# Altium schematic sheet Connector-Sheet.SchDoc
size 420 x 297 mm; SheetNumber: 3; SheetTotal: 3
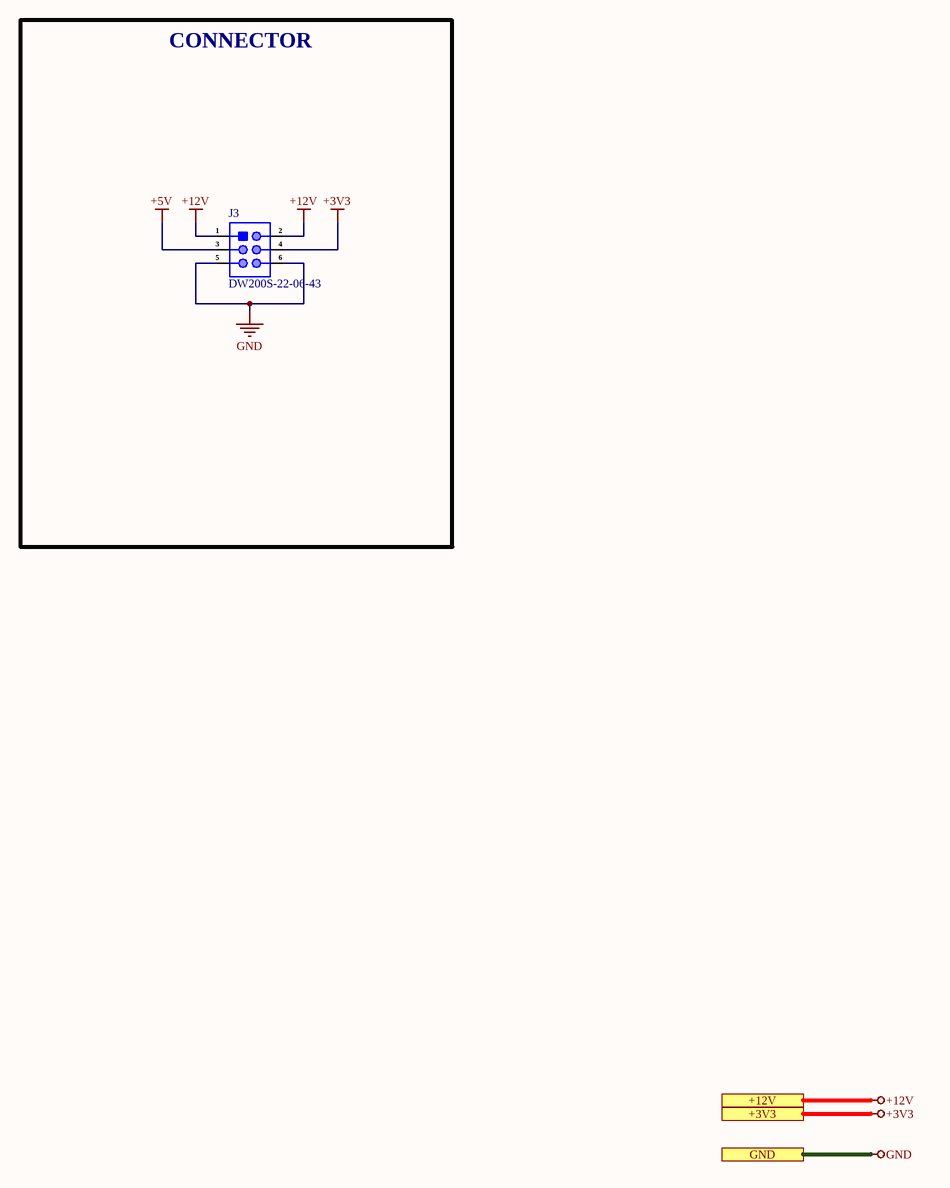
[diagram p0: Connector-Sheet.SchDoc]

## Parts
J3  DW200S-22-06-43  [HDR2X3 (Female SMD)]

## Blocks framed on the sheet
CONNECTOR: J3

## Ports
+3V3 (see Top-Sheet[3A], Power-Sheet[4D]), +12V (see Top-Sheet[3A], Power-Sheet[4D]), GND (see Top-Sheet[3B], Power-Sheet[4D])

## Nets
+3V3: J3.4 ; port +3V3
+5V: J3.3
+12V: J3.1 J3.2 ; port +12V
GND: J3.5 J3.6 ; port GND

## Notes on the sheet
- File:
- Title:
- Date:
- Page
- Num:
- Total:
- Drawn By: Huzaifa Ali

## Library data of the parts
J3 = DW200S-22-06-43: 2mm 双排 6P Brick nogging 2x3P SMD,P=2mm Female Headers ROHS; Manufacturer: DEALON; Manufacturer Part Number: DW200S-22-06-43; Package: SMD,P=2mm; LCSC Part Number: C5160809; Item Type: Female Header; ComponentLink1Description: LCSC; ComponentLink1URL: https://www.lcsc.com/product-detail/span-style-background-color-ff0-Female-span-Headers_DEALON-DW200S-22-06-43_C5160809.html